# Altium schematic sheet Digital Input.SchDoc
size A4; SheetNumber: 3; SheetTotal: 11
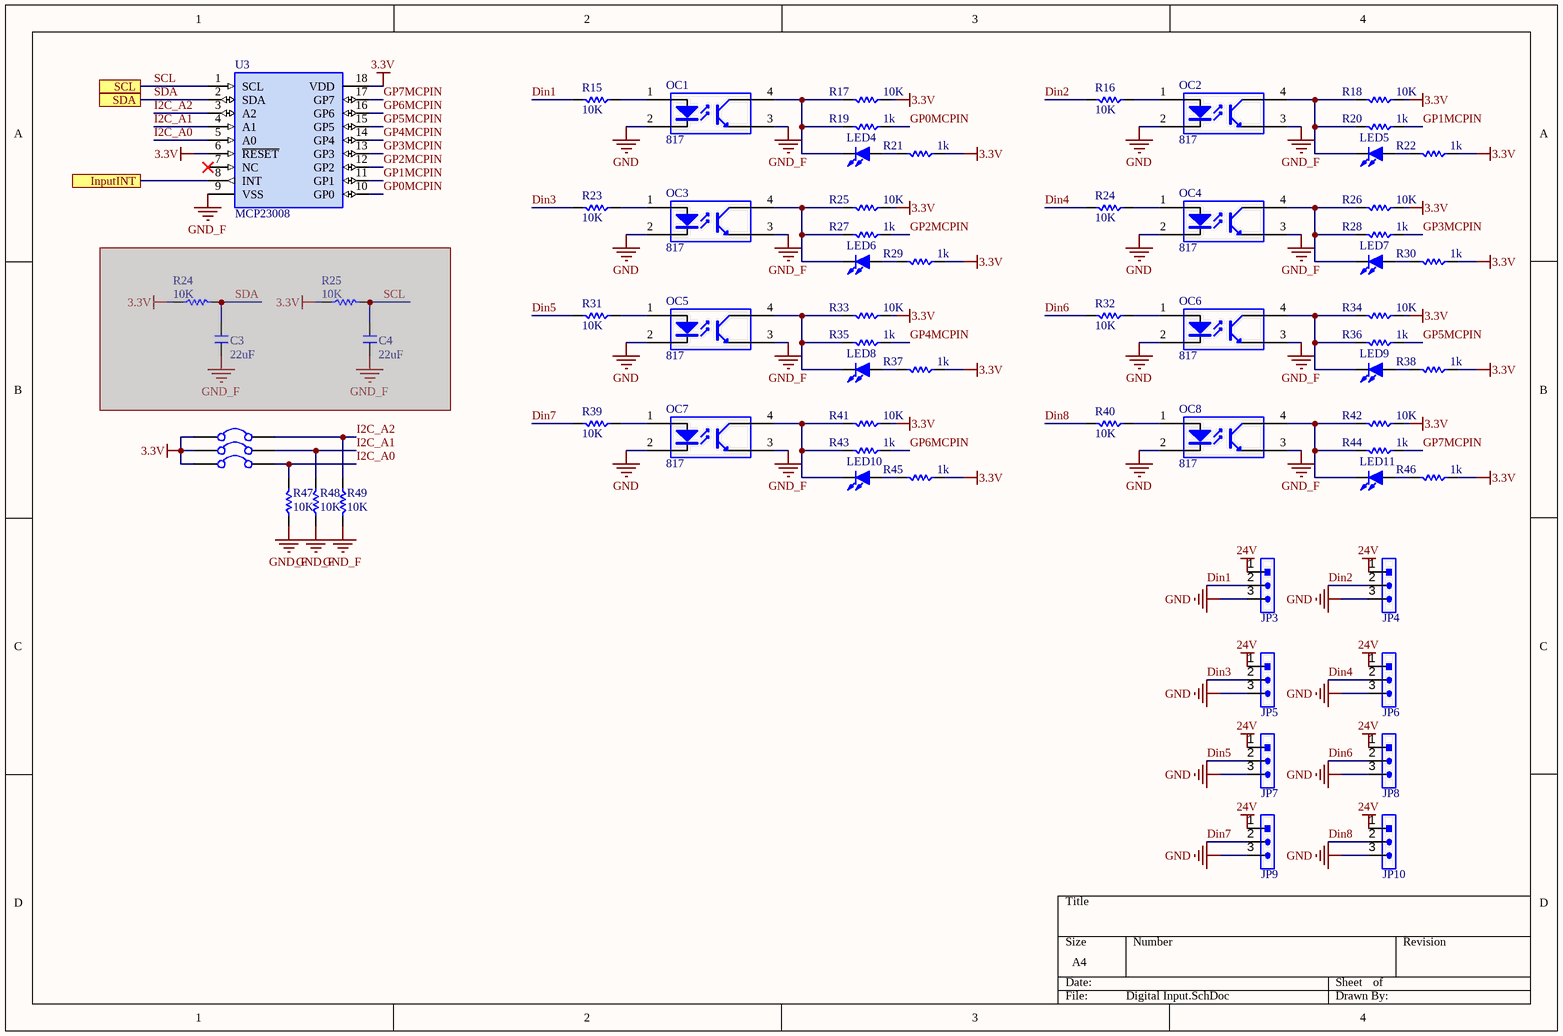
[diagram p0: Digital Input.SchDoc]

## Parts
(Parts that share a designator on the sheet are numbered #1, #2 ... from top to bottom, then left to right.)
C3  22uF  [C 0805]  (masked out: inside a compile mask, not in the netlist)
C4  22uF  [C 0805]  (masked out: inside a compile mask, not in the netlist)
JP3  HDR-1X3  [KF301-3P]  (value not drawn)
JP4  HDR-1X3  [KF301-3P]  (value not drawn)
JP5  HDR-1X3  [KF301-3P]  (value not drawn)
JP6  HDR-1X3  [KF301-3P]  (value not drawn)
JP7  HDR-1X3  [KF301-3P]  (value not drawn)
JP8  HDR-1X3  [KF301-3P]  (value not drawn)
JP9  HDR-1X3  [KF301-3P]  (value not drawn)
JP10  HDR-1X3  [KF301-3P]  (value not drawn)
LED4  LED-SMD  [LED 0805B]  (value not drawn)
LED5  LED-SMD  [LED 0805B]  (value not drawn)
LED6  LED-SMD  [LED 0805B]  (value not drawn)
LED7  LED-SMD  [LED 0805B]  (value not drawn)
LED8  LED-SMD  [LED 0805B]  (value not drawn)
LED9  LED-SMD  [LED 0805B]  (value not drawn)
LED10  LED-SMD  [LED 0805B]  (value not drawn)
LED11  LED-SMD  [LED 0805B]  (value not drawn)
OC1  817  [PC817-SMD]
OC2  817  [PC817-SMD]
OC3  817  [PC817-SMD]
OC4  817  [PC817-SMD]
OC5  817  [PC817-SMD]
OC6  817  [PC817-SMD]
OC7  817  [PC817-SMD]
OC8  817  [PC817-SMD]
R15  10K  [R 0805]
R16  10K  [R 0805]
R17  10K  [R 0805]
R18  10K  [R 0805]
R19  1k  [R 0805]
R20  1k  [R 0805]
R21  1k  [R 0805]
R22  1k  [R 0805]
R23  10K  [R 0805]
R24#1  10K  [R 0805]
R24#2  10K  [R 0805]  (masked out: inside a compile mask, not in the netlist)
R25#1  10K  [R 0805]
R25#2  10K  [R 0805]  (masked out: inside a compile mask, not in the netlist)
R26  10K  [R 0805]
R27  1k  [R 0805]
R28  1k  [R 0805]
R29  1k  [R 0805]
R30  1k  [R 0805]
R31  10K  [R 0805]
R32  10K  [R 0805]
R33  10K  [R 0805]
R34  10K  [R 0805]
R35  1k  [R 0805]
R36  1k  [R 0805]
R37  1k  [R 0805]
R38  1k  [R 0805]
R39  10K  [R 0805]
R40  10K  [R 0805]
R41  10K  [R 0805]
R42  10K  [R 0805]
R43  1k  [R 0805]
R44  1k  [R 0805]
R45  1k  [R 0805]
R46  1k  [R 0805]
R47  10K  [R 0805]
R48  10K  [R 0805]
R49  10K  [R 0805]
SB4  Solder Bridge  [Solder Bridge Open]  (value not drawn)
SB5  Solder Bridge  [Solder Bridge Open]  (value not drawn)
SB6  Solder Bridge  [Solder Bridge Open]  (value not drawn)
U3  MCP23008  [SOP18W_M]

## Ports
InputINT, SCL, SDA

## Nets
3.3V: R17.1 R18.1 R21.1 R22.1 R25#1.1 R26.1 R29.1 R30.1 R33.1 R34.1 R37.1 R38.1 R41.1 R42.1 R45.1 R46.1 SB4.1 SB5.1 SB6.1 U3.6(~{RESET}) U3.18(VDD)
24V: JP3.1 JP4.1 JP5.1 JP6.1 JP7.1 JP8.1 JP9.1 JP10.1
GND: JP3.3 JP4.3 JP5.3 JP6.3 JP7.3 JP8.3 JP9.3 JP10.3 OC1.2(K) OC2.2(K) OC3.2(K) OC4.2(K) OC5.2(K) OC6.2(K) OC7.2(K) OC8.2(K)
GND_F: OC1.3(E) OC2.3(E) OC3.3(E) OC4.3(E) OC5.3(E) OC6.3(E) OC7.3(E) OC8.3(E) R47.1 R48.1 R49.2 U3.9(VSS)
Din1: JP3.2 R15.2
Din2: JP4.2 R16.2
Din3: JP5.2 R23.2
Din4: JP6.2 R24#1.2
Din5: JP7.2 R31.2
Din6: JP8.2 R32.2
Din7: JP9.2 R39.2
Din8: JP10.2 R40.2
GP0MCPIN: R19.1 U3.10(GP0)
GP1MCPIN: R20.1 U3.11(GP1)
GP2MCPIN: R27.1 U3.12(GP2)
GP3MCPIN: R28.1 U3.13(GP3)
GP4MCPIN: R35.1 U3.14(GP4)
GP5MCPIN: R36.1 U3.15(GP5)
GP6MCPIN: R43.1 U3.16(GP6)
GP7MCPIN: R44.1 U3.17(GP7)
I2C_A0: R47.2 SB6.2 U3.5(A0)
I2C_A1: R48.2 SB5.2 U3.4(A1)
I2C_A2: R49.1 SB4.2 U3.3(A2)
InputINT: U3.8(INT) ; port InputINT
SCL: U3.1(SCL) ; port SCL
SDA: U3.2(SDA) ; port SDA
NetLED4_1: LED4.1(A) R21.2
NetLED4_2: LED4.2(K) OC1.4(C) R17.2 R19.2
NetLED5_1: LED5.1(A) R22.2
NetLED5_2: LED5.2(K) OC2.4(C) R18.2 R20.2
NetLED6_1: LED6.1(A) R29.2
NetLED6_2: LED6.2(K) OC3.4(C) R25#1.2 R27.2
NetLED7_1: LED7.1(A) R30.2
NetLED7_2: LED7.2(K) OC4.4(C) R26.2 R28.2
NetLED8_1: LED8.1(A) R37.2
NetLED8_2: LED8.2(K) OC5.4(C) R33.2 R35.2
NetLED9_1: LED9.1(A) R38.2
NetLED9_2: LED9.2(K) OC6.4(C) R34.2 R36.2
NetLED10_1: LED10.1(A) R45.2
NetLED10_2: LED10.2(K) OC7.4(C) R41.2 R43.2
NetLED11_1: LED11.1(A) R46.2
NetLED11_2: LED11.2(K) OC8.4(C) R42.2 R44.2
NetOC1_1: OC1.1(A) R15.1
NetOC2_1: OC2.1(A) R16.1
NetOC3_1: OC3.1(A) R23.1
NetOC4_1: OC4.1(A) R24#1.1
NetOC5_1: OC5.1(A) R31.1
NetOC6_1: OC6.1(A) R32.1
NetOC7_1: OC7.1(A) R39.1
NetOC8_1: OC8.1(A) R40.1

Not connected (* = marked no-connect by the designer): U3 7(NC)*

## Library data of the parts
C3 C4 = C: Non-polar patch capacitor; BOM名称: 无极性贴片电容; 版权归属: 源创客; 学习资源: www.ooocke.com
JP3-JP10 = Header 3: 3P Connector; BOM名称: 3P接插件; 版权归属: 源创客; 学习资源: www.ooocke.com
LED4-LED11 = LED-SMD: Patch LED; BOM名称: 贴片LED; 版权归属: 源创客; 学习资源: www.ooocke.com
OC1-OC8 = 817: AC Input Photocoupler; BOM名称: 线性光耦; 版权归属: 源创客; 学习资源: www.ooocke.com
R15-R23 R24#1 R24#2 R25#1 R25#2 R26-R49 = R: Chip resistor; 版权归属: 源创客; BOM名称: Chip resistor; 学习资源: www.ooocke.com
U3 = MCP23008: 8 Bit I/O Expander